# EAGLE design Ethernet_Module_r1 (EAGLE 7.7.0)
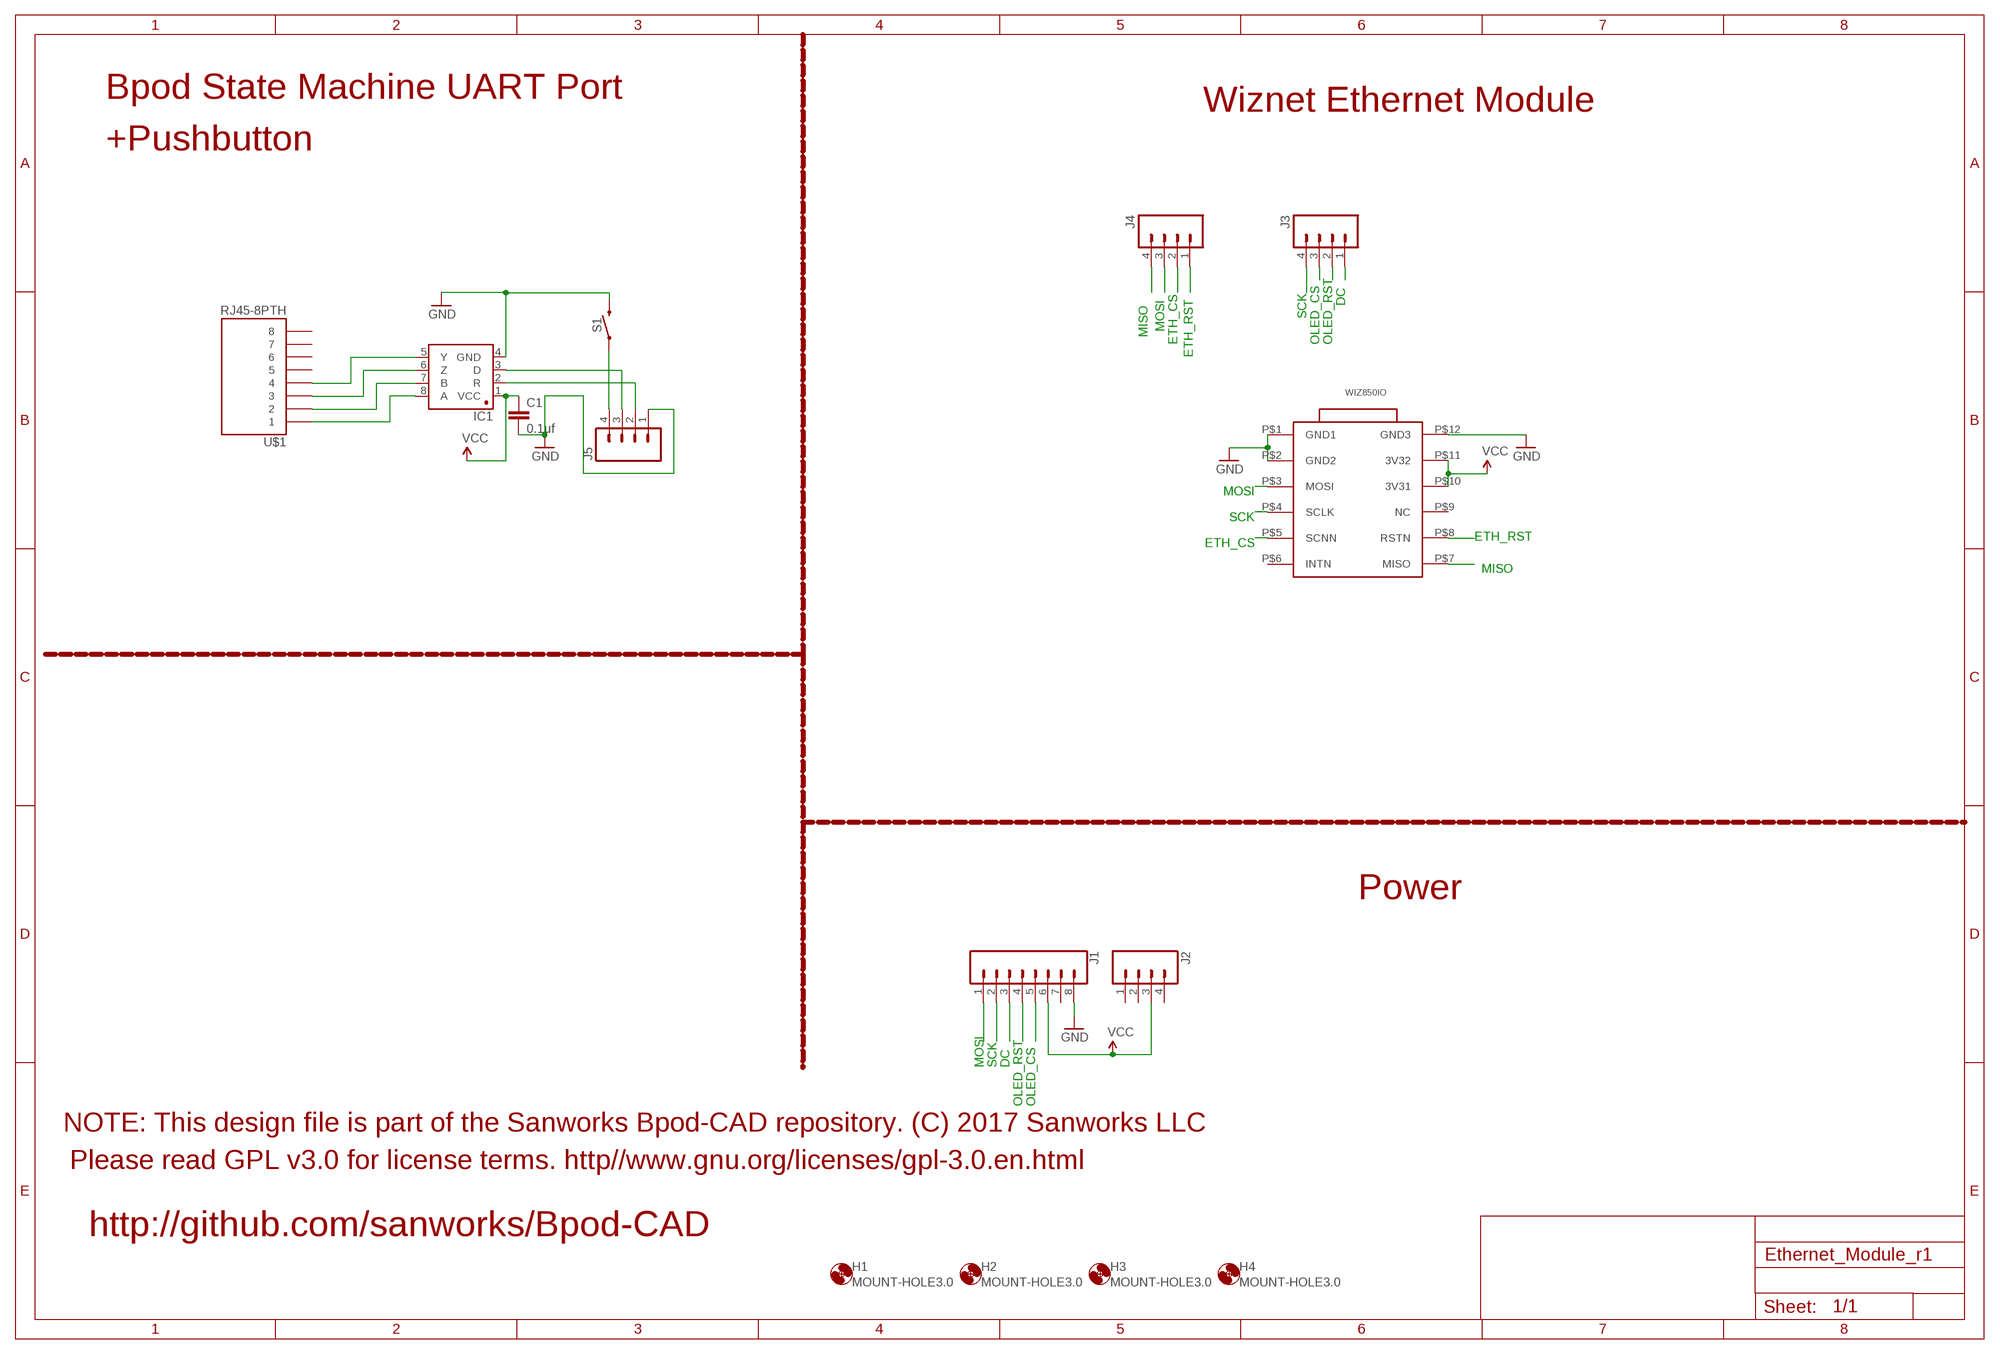
[diagram p0: schematic, sheet 1]

## Parts
C1  0.1uf  CAP1206  [1206@1]
H1  MOUNT-HOLE3.0  [3,0]
H2  MOUNT-HOLE3.0  [3,0]
H3  MOUNT-HOLE3.0  [3,0]
H4  MOUNT-HOLE3.0  [3,0]
IC1  SN65HVD31DR  [SO08]
J1  CONN_08LONGPADS  [1X08_LONGPADS]
J2  M04PTH  [1X04]
J3  M04PTH  [1X04]
J4  M04PTH  [1X04]
J5  M04PTH  [1X04]
S1  MOMENTARY-SWITCH-SPST-SMD-5.2MM  [TACTILE_SWITCH_SMD_5.2MM]
U$1  RJ45-8PTH  [RJ45-8]
WIZ850IO  WIZ850IO  [WIZ850IO]

## Nets
DC: J1.3 J3.1
ETH_CS: J4.2 WIZ850IO.P$5(SCNN)
ETH_RST: J4.1 WIZ850IO.P$8(RSTN)
GND: C1.2 IC1.4(GND) J1.8 J5.1 S1.3 WIZ850IO.P$1(GND1) WIZ850IO.P$2(GND2) WIZ850IO.P$12(GND3)
MISO: J4.4 WIZ850IO.P$7(MISO)
MOSI: J1.1 J4.3 WIZ850IO.P$3(MOSI)
N$1: J5.4 S1.1
N$7: IC1.8(A) U$1.1
N$8: IC1.7(B) U$1.2
N$9: IC1.6(Z) U$1.3
N$10: IC1.5(Y) U$1.4
OLED_CS: J1.5 J3.3
OLED_RST: J1.4 J3.2
RX1: IC1.2(R) J5.2
SCK: J1.2 J3.4 WIZ850IO.P$4(SCLK)
TX1: IC1.3(D) J5.3
VCC: C1.1 IC1.1(VCC) J1.6 J2.3 WIZ850IO.P$10(3V31) WIZ850IO.P$11(3V32)
Unconnected: J1.7 J2.1 J2.2 J2.4 U$1.5 U$1.6 U$1.7 U$1.8 WIZ850IO.P$6(INTN) WIZ850IO.P$9(NC)

## Notes on the sheet
- Bpod State Machine UART Port
- Wiznet Ethernet Module
- +Pushbutton
- ETH_RST
- MISO | DC
- SCK
- MOSI
- ETH_CS | OLED_CS | OLED_RST
- MOSI
- SCK
- ETH_RST
- ETH_CS
- MISO
- Power
- MOSI | SCK | DC
- OLED_RST | OLED_CS
- NOTE: This design file is part of the Sanworks Bpod-CAD repository. (C) 2017 Sanworks LLC
- Please read GPL v3.0 for license terms. http//www.gnu.org/licenses/gpl-3.0.en.html
- http://github.com/sanworks/Bpod-CAD

## Library data of the parts
C1 = SparkFun-Capacitors:CAP: Capacitor Standard 0603 ceramic capacitor, and 0.1" leaded capacitor.
H1-H4 = holes:MOUNT-HOLE: MOUNTING HOLE with drill center marker
IC1 = Joshparts4:SN65HVD31DR: A placeholder for generic narrow & wide SOIC8 foorptints - used on the DIP adapter board.
J1 = SparkFun-Connectors:CONN_08: Multi connection point. Often used as Generic Header-pin footprint for 0.1 inch spaced/style header connections On any of the 0.1 inch spaced packages, you can populate with these: Break Away Headers - Straight <https://www.sparkfun.com/products/116> (PRT-00116) Break Away Male Headers - Right Angle <https://www.sparkfun.com/products/553> (PRT-00553) Female Headers <https://www.sparkfun.com/products/115> (PRT-00115) Break Away Headers - Machine Pin <https://www.sparkfun.com/products/117> (PRT-00117) Break Away Female Headers - Swiss Machine Pin <https://www.sparkfun.com/products/743> (PRT-00743) Arduino Stackable Header - 8 Pin <https://www.sparkfun.com/products/9279> (PRT-09279) For SCREWTERMINALS and SPRING TERMINALS visit here: Screw Terimnals on SparkFun.com <https://www.sparkfun.com/search/results?term=Screw+Terminals> (5mm/3.5mm/2.54mm spacing) This device is also useful as a general connection point to wire up your design to another part of your project. Our various solder wires solder well into these plated through hole pads. Hook-Up Wire - Assortment (Stranded, 22 AWG) <https://www.sparkfun.com/products/11375> (PRT-11375) Hook-Up Wire - Assortment (Solid Core, 22 AWG) <https://www.sparkfun.com/products/11367> (PRT-11367) View the entire wire category on our website here <https://www.sparkfun.com/categories/141> Special notes: Molex polarized connector foot print use with SKU : PRT-08231 with associated crimp pins and housings. 1MM SMD Version SKU: PRT-10208 NOTES ON THE VARIANTS LOCK and LOCK_LONGPADS... This footprint was designed to help hold the alignment of a through-hole component (i.e. 6-pin header) while soldering it into place. You may notice that each hole has been shifted either up or down by 0.005 of an inch from it's more standard position (which is a perfectly straight line). This slight alteration caused the pins (the squares in the middle) to touch the edges of the holes. Because they are alternating, it causes a "brace" to hold the component in place. 0.005 has proven to be the perfect amount of "off-center" position when using our standard breakaway headers. Although looks a little odd when you look at the bare footprint, once you have a header in there, the alteration is very hard to notice. Also,if you push a header all the way into place, it is covered up entirely on the bottom side.
J2-J5 = SparkFun-Connectors:M04: Header 4 Standard 4-pin 0.1" header. Use with straight break away headers (SKU : PRT-00116), right angle break away headers (PRT-00553), swiss pins (PRT-00743), machine pins (PRT-00117), and female headers (PRT-00115). Molex polarized connector foot print use with SKU : PRT-08231 with associated crimp pins and housings. 1MM SMD Version SKU: PRT-10208; PROD_ID: CONN-09696
S1 = SparkFun-Switches:MOMENTARY-SWITCH-SPST: Momentary Switch (Pushbutton) - SPST Normally-open (NO) SPST momentary switches (buttons, pushbuttons). Variants PTH-12MM - 12mm square, through-hole Momentary Pushbutton Switch - 12mm Square <https://www.sparkfun.com/products/9190> (COM-09190) PTH-6.0MM, PTH-6.0MM-KIT - 6.0mm square, through-hole Mini Pushbutton Switch <https://www.sparkfun.com/products/97> (COM-00097) KIT package intended for soldering kit's - only one side of pads' copper is exposed. PTH-RIGHT-ANGLE-KIT - Right-angle, through-hole Right Angle Tactile Button <https://www.sparkfun.com/products/10791> - Used on SparkFun BigTime Watch Kit <https://www.sparkfun.com/products/11734> SMD-12MM - 12mm square, surface-mount Tactile Button - SMD (12mm) <https://www.sparkfun.com/products/12993> (COM-12993) Used on SparkFun PicoBoard <https://www.sparkfun.com/products/11888> SMD-4.5MM - 4.5mm Square Trackball Switch Used on SparkFun Blackberry Trackballer Breakout <https://www.sparkfun.com/products/13169> SMD-4.6MMX2.8MM - 4.60mm x 2.80mm, surface mount Used on SparkFun SAMD21 Mini Breakout <https://www.sparkfun.com/products/13664> SMD-5.2MM, SMD-5.2-REDUNDANT - 5.2mm square, surface-mount Mini Pushbutton Switch - SMD <https://www.sparkfun.com/products/8720> (COM-08720) Used on Arduino Pro Mini <https://www.sparkfun.com/products/11114> REDUNDANT package connects both switch circuits together SMD-6.0X3.5MM - 6.0 x 3.5mm, surface mount Momentary Reset Switch SMD <https://www.sparkfun.com/products/8229> (COM-08229) SMD-6.2MM-TALL - 6.2mm square, surface mount Tactile Button - SMD (6mm) <https://www.sparkfun.com/products/12992> Used on SparkFun Digital Sandbox <https://www.sparkfun.com/products/12651> SMD-RIGHT-ANGLE - Right-angle, surface mount Used on SparkFun Block for Intel® Edison - Arduino <https://www.sparkfun.com/products/13036>; PROD_ID: SWCH-08247; SF_SKU: COM-08720
U$1 = SparkFun:RJ45-8: RJ45 Jack Simple RJ45, 8-pin connection - connector for common Cat5, Cat5e, and Cat6 Ethernet cables. Footprint not yet proven in production. Connector sku is PRT-00643; Breakout PCB sku is BOB-00716.
WIZ850IO = JoshParts10:WIZ850IO

## Board
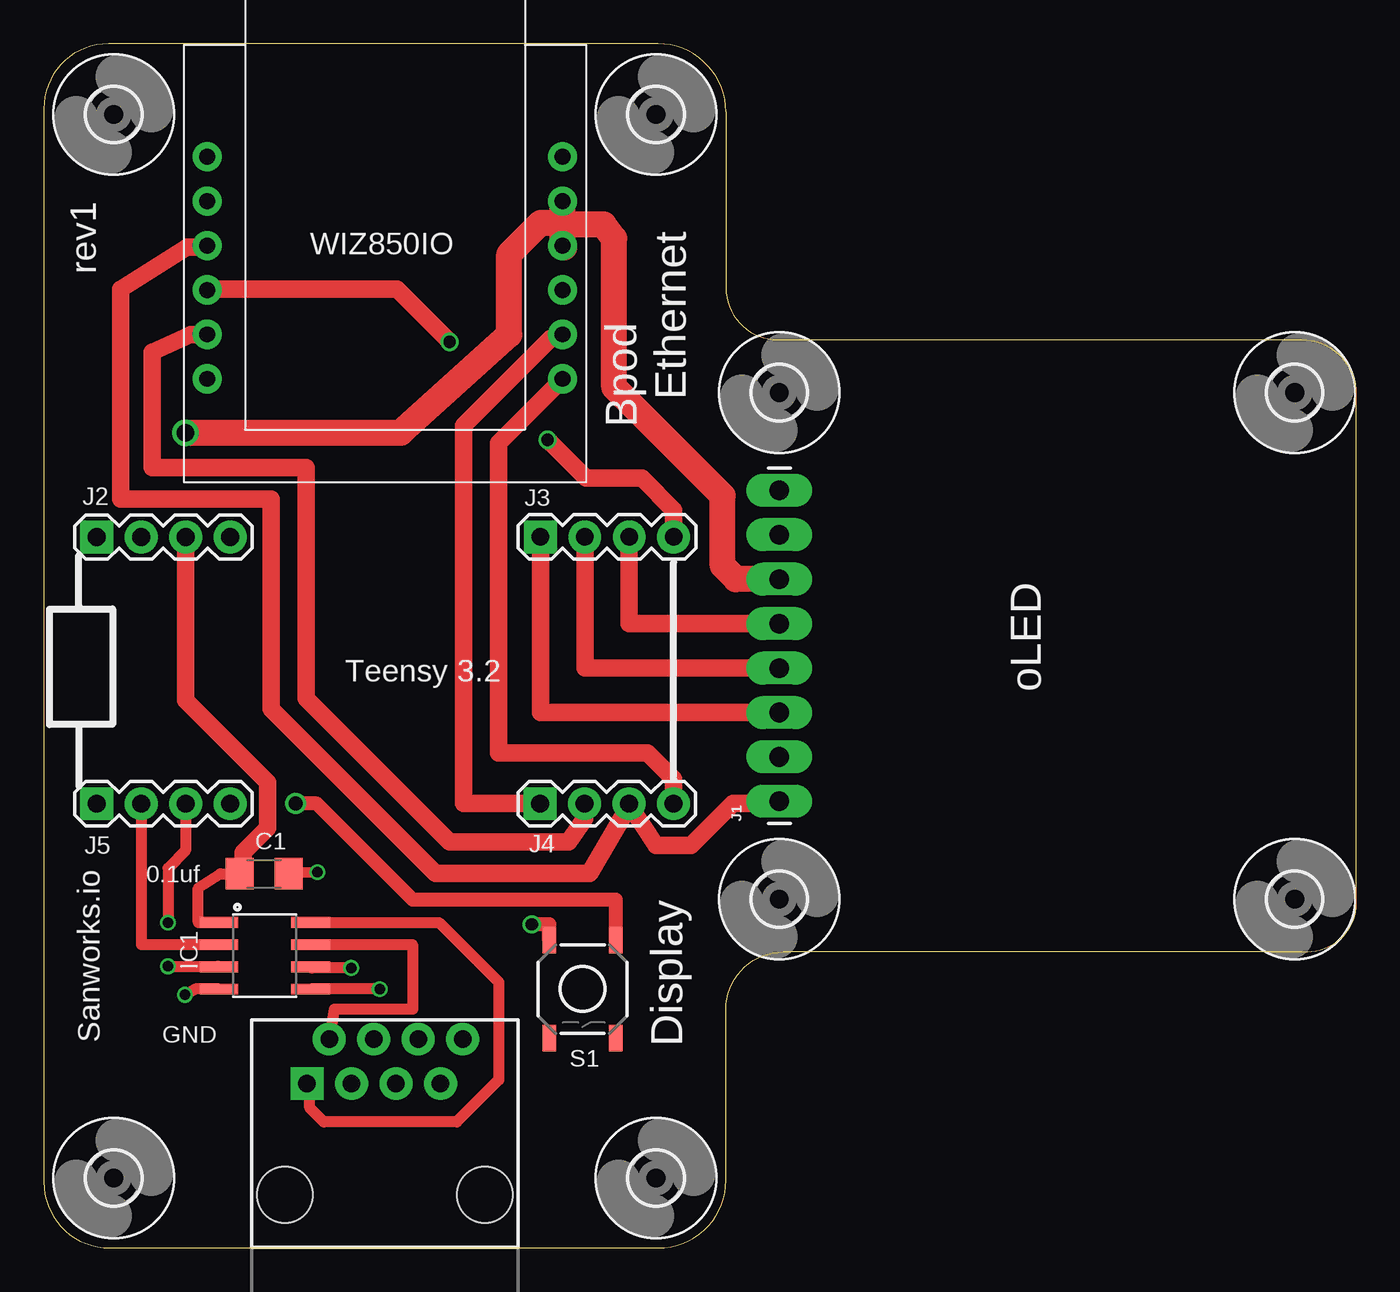
[diagram p1: board, top side]
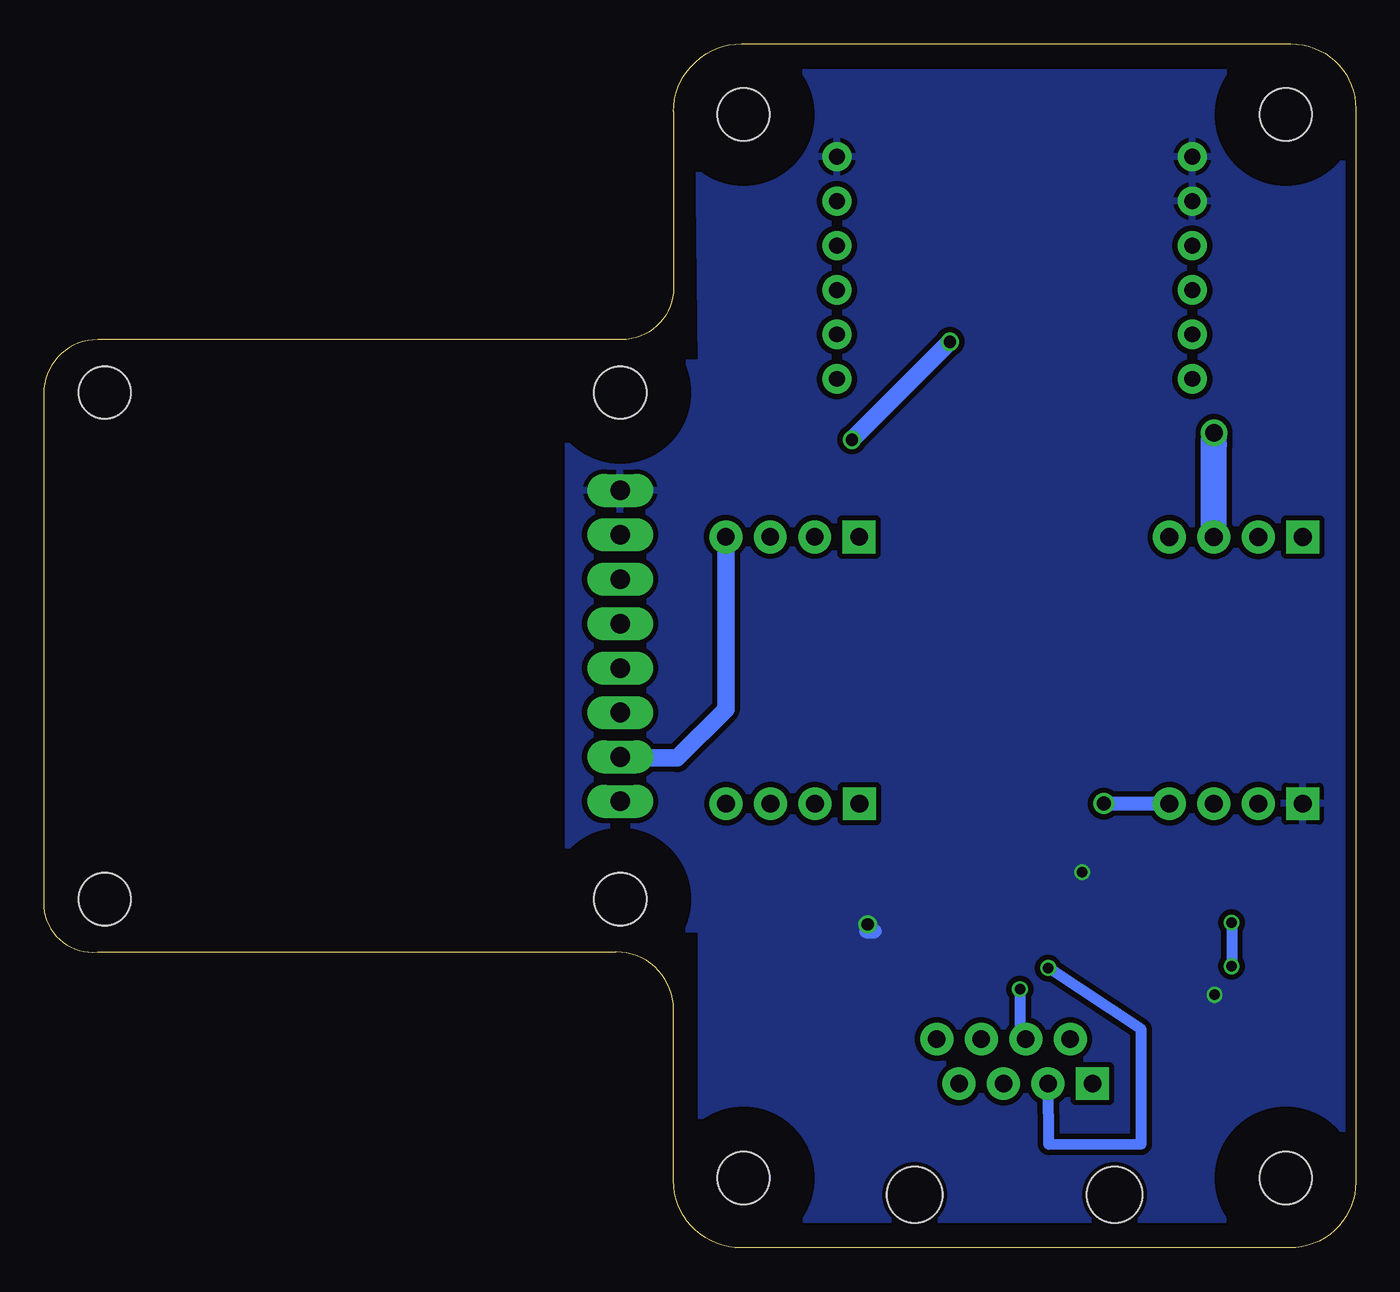
[diagram p2: board, bottom side, seen from below]

Size 75 x 68.84 mm. Coordinates in mm from the lower left corner, seen from the top.
Outline: 39,64.94 39,54.87 arc90 41.95,51.92 71.93,51.92 arc-90 75,48.85 75,19.46 arc-90 71.93,16.92 42.28,16.92 arc90 39,13.64 39,3.86 arc-90 35.14,0 3.77,0 arc-90 0,3.77 0,65.13 arc-90 3.71,68.84 35.1,68.84 arc-90 39,64.94
Copper layers (1*16): Top 0.035mm / dielectric 1.5mm / Bottom 0.035mm
Design rules "SeeedStudio_2layer_DRU_no_angle_20140221 *": minimum track width 6mil, minimum drill 12mil, track to track 12mil, track to pad 12mil, pad to pad 12mil, via to via 12mil, smd to smd 0mil, copper to edge 10mil, drill to drill 10mil, minimum pad ring 10mil, minimum via ring 6mil, stop-mask expansion 2mil, vias tented up to drill 100mil, thermal gap 10mil

### Footprints (pad centres in the part's own frame; a part is rotated, then mirrored left to right if it is on the bottom)
1206@1 = smd 1.6 x 1.8: 1 -1.4,0; 2 1.4,0
3,0 = hole 3: 0,0
SO08 = smd 0.61 x 2.21: 1 -1.905,-2.616; 2 -0.635,-2.616; 3 0.635,-2.616; 4 1.905,-2.616; 5 1.905,2.616; 6 0.635,2.616; 7 -0.635,2.616; 8 -1.905,2.616
1X08_LONGPADS = drill 1.118 pad 1.88 long: 1 0,0; 2 2.54,0; 3 5.08,0; 4 7.62,0; 5 10.16,0; 6 12.7,0; 7 15.24,0; 8 17.78,0
1X04 = drill 1.016 pad 1.88 square: 1 0,0 | drill 1.016 pad 1.88: 2 2.54,0; 3 5.08,0; 4 7.62,0
TACTILE_SWITCH_SMD_5.2MM = smd 1.524 x 0.762: 1 -2.794,1.905; 2 2.794,1.905; 3 -2.794,-1.905; 4 2.794,-1.905
RJ45-8 = drill 1 pad 1.88 square: 1 -4.445,6.35 | drill 1 pad 1.88: 2 -3.175,8.89; 3 -1.905,6.35; 4 -0.635,8.89; 5 0.635,6.35; 6 1.905,8.89; 7 3.175,6.35; 8 4.445,8.89 | hole 3.2: -5.715,0; 5.715,0
WIZ850IO = drill 0.9 pad 1.676: P$1 -10.16,5.08; P$2 -10.16,2.54; P$3 -10.16,0; P$4 -10.16,-2.54; P$5 -10.16,-5.08; P$6 -10.16,-7.62; P$7 10.16,-7.62; P$8 10.16,-5.08; P$9 10.16,-2.54; P$10 10.16,0; P$11 10.16,2.54; P$12 10.16,5.08

### Placement (x,y rotation side)
C1  12.6,21.39 0 top
H1  4,4 0 top
H2  35,4 0 top
H3  35,64.8 0 top
H4  4,64.8 0 top
H5  MOUNT-HOLE3.0  [3,0]  42.05,48.9 0 top
H6  MOUNT-HOLE3.0  [3,0]  42.05,19.94 0 top
H7  MOUNT-HOLE3.0  [3,0]  71.51,48.9 0 top
H8  MOUNT-HOLE3.0  [3,0]  71.51,19.94 0 top
IC1  12.64,16.71 270 top
J1  42.05,25.53 90 top
J2  3.03,40.64 0 top
J3  28.39,40.65 0 top
J4  28.38,25.4 0 top
J5  3.03,25.4 0 top
S1  30.8,14.8 270 top
U$1  19.5,3.05 0 top
WIZ850IO  19.5,57.3 0 top

### Tracks (layer width: path | path; a pad name or v marks a point on that pad's centre or on a via)
DC
  Top 1: J3.1 28.39,30.61 J1.3
ETH_CS
  Top 1: J4.2 30.91,24.52 30,23.2 23.2,23.2 15,31.4 15,44.6 6.2,44.6 6.2,51.2 8.4,52.2 9.32,52.2 WIZ850IO.P$5
ETH_RST
  Top 1: J4.1 24,25.4 24,47 29,52 29.44,52 WIZ850IO.P$8
GND  (via drill 0.6, 0.7)
  Top 0.635: IC1.4 8.65,14.8 v8.07,14.48 | C1.2 14.34,21.48 v15.64,21.48
  Top 0.8: S1.3 28.89,18.5 v27.9,18.5
  Bottom 0.8: v27.9,18.5 28,18.1 27.5,18.1
  pour Bottom: 0.8,67.2 0.8,1.6 37.4,1.6 37.4,18.2 45,18.2 45,50.6 37.4,50.6 37.6,67.2
MISO
  Top 1: WIZ850IO.P$7 26,46.02 26,28.3 34.5,28.3 35.99,26.8 J4.4
MOSI
  Top 1: 33.45,25.34 35,23 37,23 39.4,25.4 41.92,25.4 J1.1 | J4.3 33.45,25.34 | 33.45,25.34 33.45,25.25 31.2,21.4 22.4,21.4 13,30.8 13,42.8 4.4,42.8 4.4,54.8 8.2,57.2 9.24,57.2 WIZ850IO.P$3
N$1  (via drill 0.8)
  Top 0.8: S1.1 32.7,19.9 21.1,19.9 15.6,25.4 v14.4,25.4
  Bottom 0.8: v14.4,25.4 J5.4
N$7
  Top 0.635: IC1.8 22.59,18.61 26,15.2 26,9.6 23.6,7.2 16,7.2 15.2,8 15.2,9.25 U$1.1
N$8
  Top 0.635: IC1.7 21.08,17.34 21.09,14.99 21.09,13.65 16.61,13.65 U$1.2
N$9  (via drill 0.6)
  Top 0.635: v17.58,16 15.32,16 IC1.6
  Bottom 0.635: U$1.3 17.57,5.93 12.26,5.95 12.26,12.48 v17.58,16
N$10  (via drill 0.6)
  Top 0.625: v19.2,14.8 IC1.5
  Bottom 0.635: v19.2,14.8 19.2,12.27 U$1.4
OLED_CS
  Top 1: J3.3 33.47,35.69 J1.5
OLED_RST
  Top 1: J3.2 30.93,33.15 J1.4
RX1
  Top 0.625: J5.2 5.57,17.34 IC1.2
SCK  (via drill 0.7)
  Top 1: J3.4 36.01,42.19 34.2,44 31,44 v28.8,46.2 | v23.2,51.8 20.2,54.8 9.38,54.8 WIZ850IO.P$4
  Bottom 0.6: 41.98,28 J1.2
  Bottom 1: J3.4 36.01,30.79 38.8,28 41.98,28 | v28.8,46.2 v23.2,51.8
TX1  (via drill 0.6)
  Top 0.625: J5.3 8.11,22.71 7.1,21.7 v7.1,18.6 | v7.1,16.1 9.95,16.1 IC1.3
  Bottom 0.625: v7.1,18.6 v7.1,16.1
VCC  (via drill 1)
  Top 0.635: IC1.1 8.83,18.61 8.83,20.57 10.1,21.39 C1.1
  Top 1: J2.3 8.11,31.29 12.8,26.6 12.8,24 11.4,22.6 11.4,21.6 C1.1
  Top 1.5: J1.6 39.57,38.23 38.8,39 38.8,43 32.6,49.2 32.6,57.7 32,58.5 29.66,58.5 | 29.76,57.2 WIZ850IO.P$10 29.66,58.5 | 29.66,58.5 29.66,58.6 | 29.66,58.6 WIZ850IO.P$11 | v8.1,46.6 20.4,46.6 26.6,52.2 26.6,56.8 28.4,58.6 29.66,58.6
  Bottom 1.5: J2.3 8.11,45.91 v8.1,46.6

### Text on the board
tPlace: rev1 | Ethernet | Bpod | Teensy 3.2 | oLED | Sanworks.io | 0.1uf | Display | GND